# Altium schematic sheet Power_supply.SchDoc
size A; SheetNumber: 3; SheetTotal: 8
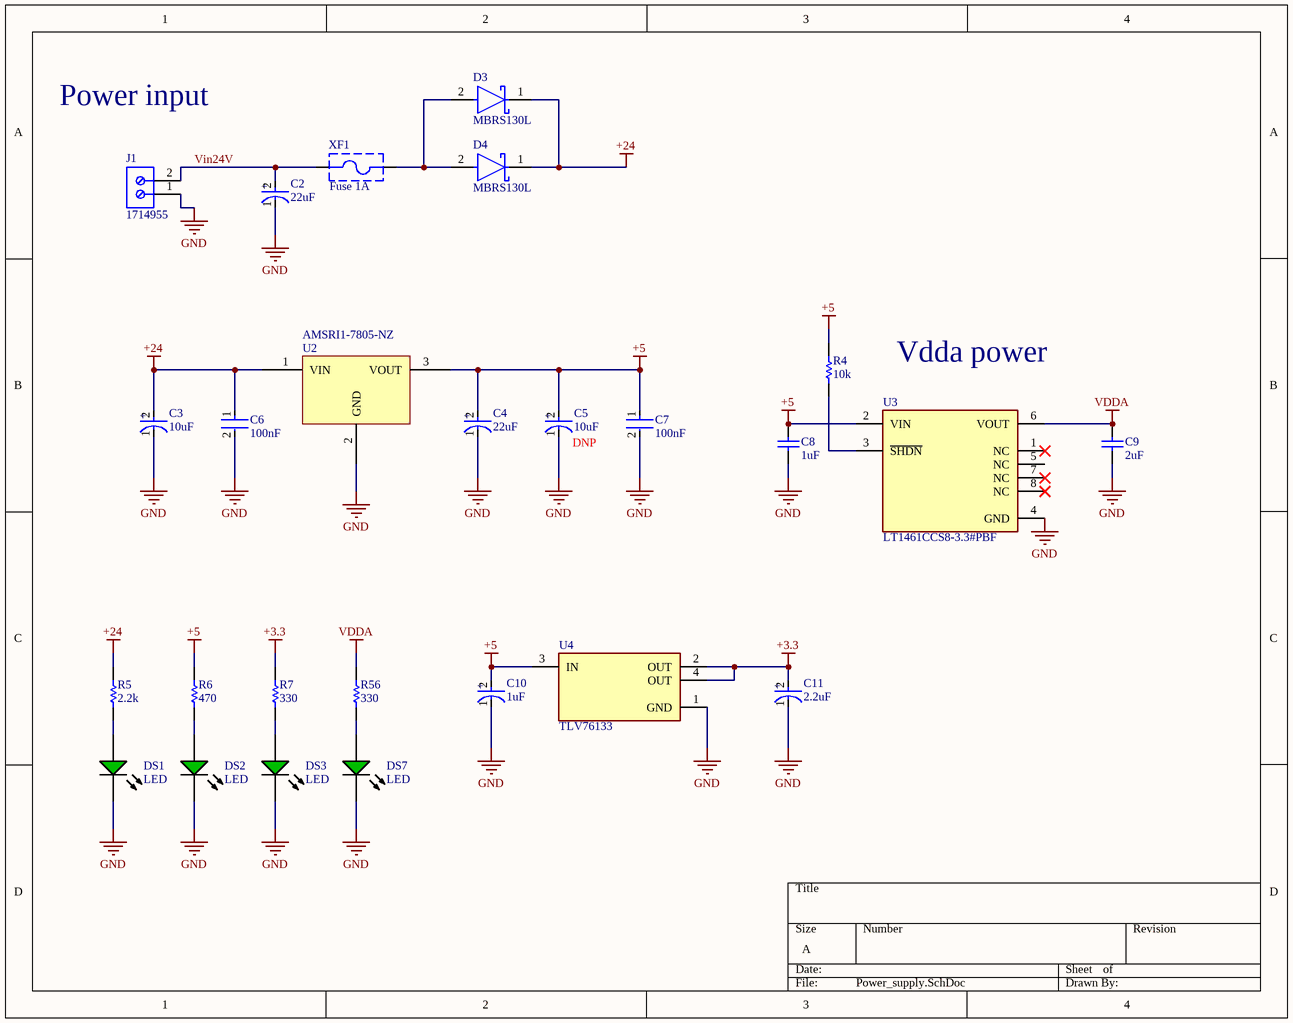
[diagram p0: Power_supply.SchDoc]

## Parts
C2  22uF  [FP-FCE-MFG]
C3  10uF  [FP-FKD-MFG]
C4  22uF  [FP-FCE-MFG]
C5  10uF  [FP-FKD-MFG]
C6  100nF  [FP-0805-L_2_01_0_2-W_1_25-IPC_B]
C7  100nF  [FP-0805-L_2_01_0_2-W_1_25-IPC_B]
C8  1uF  [CAPC2013X140X50LL20T25]
C9  2uF  [CAPC2013X140X50LL20T25]
C10  1uF  [FP-FKD-MFG]
C11  2.2uF  [FP-FKD-MFG]
D3  MBRS130L  [FP-403AF-MFG]
D4  MBRS130L  [FP-403AF-MFG]
DS1  LED  [AVAG-HSMX-C170_V]
DS2  LED  [AVAG-HSMX-C170_V]
DS3  LED  [AVAG-HSMX-C170_V]
DS7  LED  [AVAG-HSMX-C170_V]
J1  1714955  [PHOE-1714955_V]
R4  10k  [RESC2013X50X30LL20T20]
R5  2.2k  [RESC2013X50X30LL20T20]
R6  470  [RESC2013X50X30LL20T20]
R7  330  [RESC2013X50X30LL20T20]
R56  330  [RESC2013X50X30LL20T20]
U2  AMSRI1-7805-NZ  [SIP750W46P254L1400H1010Q3]
U3  LT1461CCS8-3.3#PBF  [FP-S8-8-05-08-1610-IPC_A]
U4  TLV76133  [FP-DCY0004A-MFG]
XF1  Fuse 1A  [696106003002]

## Nets
+3.3: C11.2(A) R7.2 U4.2(OUT) U4.4(OUT)
+5: C4.2(A) C5.2(A) C7.1 C8.2 C10.2(A) R4.2 R6.2 U2.3(VOUT) U3.2(VIN) U4.3(IN)
+24: C3.2(A) C6.1 D3.1(C) D4.1(C) R5.2 U2.1(VIN)
GND: C2.1(C) C3.1(C) C4.1(C) C5.1(C) C6.2 C7.2 C8.1 C9.1 C10.1(C) C11.1(C) DS1.2(K) DS2.2(K) DS3.2(K) DS7.2(K) J1.1 U2.2(GND) U3.4(GND) U4.1(GND)
VDDA: C9.2 R56.2 U3.6(VOUT)
Vin24V: C2.2(A) J1.2 XF1.1
NetD3_2: D3.2(A) D4.2(A) XF1.2
NetDS1_1: DS1.1(A) R5.1
NetDS2_1: DS2.1(A) R6.1
NetDS3_1: DS3.1(A) R7.1
NetDS7_1: DS7.1(A) R56.1
NetR4_1: R4.1 U3.3(~{SHDN})

Not connected (* = marked no-connect by the designer): U3 1(NC)* 5(NC) 7(NC)* 8(NC)*

## Notes on the sheet
- Power input
- Vdda power
- (near C5) DNP
- (in symbol CMP-2000-06207-2) +
- (in symbol CMP-05427-002128-1) +

## Library data of the parts
C2 C4 = CMP-05427-002128-1: CAP ALUM 22UF 20% 50V SMD; Ripple Current: 120mA; Material: Aluminium; ESR (Equivalent Series Resistance): 700mR; Polarity: Polar; Lead Length: 3.4mm; Leakage Current: 3uA; Life (Hours): 1000Hour; Diameter: 8mm; RoHS Compliant: Yes; Voltage Rating: 50V; Reach SVHC Compliant: Yes; Series: FC; Capacitance: 22uF; Ripple Current (AC): 120mA; Mount: Surface Mount; Min Operating Temperature: -40°C; Max Operating Temperature: 105°C; Radiation Hardening: No; Contact Plating: Tin; Impedance: 700mR; Construction: Cylindrical; Height - Seated (Max): 0.244inch; Packaging: Tape and Reel; Dielectric Material: Aluminium; Voltage: 50V; Voltage Rating (DC): 50V; Height: 6.2mm; Package Quantity: 1000; Length: 6.5mm; Lead Pitch: 2.2mm; Width: 8.3mm; Termination: SMD/SMT; Case/Package: Radial; Tolerance: 20%; Number of Pins: 2; Lead Free: Lead Free
C3 C5 C10 C11 = CMP-2000-06207-2: CAP ALUM 10UF 20% 50V SMD; Impedance: 880mR; Ripple Current: 165mA; Polarity: Polar; Leakage Current: 3uA; Lead Diameter: 0.65mm; Life (Hours): 2000Hour; REACH SVHC: No SVHC; Series: FK; Max Operating Temperature: 105°C; Radiation Hardening: No; Size: 5.8mm; Ripple Current (AC): 165mA; Lead Free: Lead Free; Voltage: 50V; Contact Plating: Tin; Case/Package: Radial; RoHS Compliant: Yes; Voltage Rating: 50V; Height - Seated (Max): 0.24inch; Package Quantity: 1000; Termination: SMD/SMT; Number of Pins: 2; Mount: Surface Mount; Packaging: Tape and Reel; Length: 5.8mm; Width: 7.8mm; Min Operating Temperature: -55°C; Height: 5.8mm; ESR (Equivalent Series Resistance): 880mR; Capacitance: 10uF; Diameter: 6.3mm; Voltage Rating (DC): 50V; Construction: Cylindrical; Tolerance: 20%; Lead Pitch: 1.8mm
C6 C7 = CMP-2007-04174-2: General Purpose Ceramic Capacitor, 0805, 10nF, 10%, X7R, 15%, 100V; Packaging: Tape and Reel; Min Operating Temperature: -55°C; Dielectric Material: Ceramic; Height: 1.4mm; Voltage Rating: 100V; Termination: SMD/SMT; Case Code (Imperial): 0805; Case Code (Metric): 2012; Case/Package: 0805; Construction: Flat; Radiation Hardening: No; Series: -; Dielectric: X7R; Package Quantity: 2000; Mount: Surface Mount; Capacitance: 100nF; Contact Plating: Tin; Voltage: 100V; Lead Free: Lead Free; Depth: 1.25mm; RoHS Compliant: Yes; Number of Pins: 2; Max Operating Temperature: 125°C; Length: 2.01mm; Voltage Rating (DC): 100V; Thickness: 0.055inch; REACH SVHC: No SVHC; Width: 0.049inch; Tolerance: 10%
C8 C9 = CMP-2007-03234-1: Part Number: C0805C105K3RACTU; Manufacturer: Kemet
D3 D4 = CMP-00278-20916186-1: MBRS130L Rectifier Diode, Schottky, 1 Phase, 1 Element, 2A, 30V V(RRM), Silicon, DO-214AA; Manufacturer Lifecycle Status: OBSOLETE; Output Current: 1A; Forward Voltage: 445mV; Peak Reverse Current: 1mA; Max Surge Current: 40A; Polarity: Standard; Element Configuration: Single; Max Junction Temperature (Tj): 125°C; Lead Free: Lead Free; Packaging: Cut Tape; Mount: Surface Mount; Max Repetitive Reverse Voltage (Vrrm): 30V; Forward Current: 2A; Length: 4.75mm; Weight: 180mg; Radiation Hardening: No; Max Operating Temperature: 125°C; Schedule B: 8541100080; Peak Non-Repetitive Surge Current: 40A; Height: 2.45mm; Case/Package: SMB; Min Operating Temperature: -65°C; Average Rectified Current: 2A; Lifecycle Status: Obsolete; REACH SVHC: No SVHC; Voltage Rating (DC): 30V; Max Forward Surge Current (Ifsm): 40A; NexarPartId: 20916186; Max Reverse Leakage Current: 1mA; Number of Pins: 2; Width: 3.95mm; RoHS: Compliant; Max Reverse Voltage (DC): 30V; Current Rating: 1A
DS1-DS3 DS7 = CMP-2000-05062-1: Chip LED, Green, 2.2 V, -40 to 85 degC, 2-Pin SMD, Pb-Free, Tape and Reel; Manufacturer: Avago; No. of Pins: 2; Peak Wavelength: 570nm; SVHC: NoSVHC(16-Jun-2014); Dominant Wavelength: 572nm; Forward Current If: 20mA; Viewing Angle: 170deg; Lens Shape: Rectangular; PIV Max: 5V; External Width: 1.25mm; LED Type: Standard; External Depth: 0.8mm; Opto Mounting Orientation: Top; Luminous Intensity: 15mcd; Luminous Intensity Min: 4mcd; Forward Voltage VF Max: 2.6V; External Length / Height: 2mm; Bulb Size: 1.25mmx1.4mm; Light Area Height: 1mm; Voltage Vf Typ: 2.2V; Operating Temperature Max: 85degC; Datasheet Version: Oct-08; MSL: MSL2A-4weeks; Peak Forward Current: 20mA; Package Description: 2-Pin Surface Mount Device, Body 2 x 1.25 mm, Height 0.8 mm; Datasheet URL: https://datasheet.ciiva.com/29280/180495-da-01-en-chip-led-hsmg-c170-gelb-gruen-29280971.pdf; Storage Temperature Min: -40degC; LED Colour: Green; Wavelength Typ: 570nm; Mounting Type: SMD; Forward Current If Max: 20mA; Dominant Wavelength Typ: 572nm; LED Mounting: SMD; Operating Temperature Range: -30degCto+85degC; Operating Temperature Min: -30degC; Manufacturer URL: http://www.avagotech.com/; Packaging: CutTape; Luminous Intensity Typ: 15mcd; Package Reference: HSMX-C170; Storage Temperature Max: 85degC; Opto Case Style: SMD; Forward Voltage: 2.2V
J1 = CMP-2000-05797-1: PC Terminal Block, Pitch 6.35 mm, 1 x 2 Position, Height 21.5 mm, Tail Lenght 5.1 mm, RoHS, Bulk; Manufacturer: Phoenix Contact; Package Description: PC Terminal Block, Pitch 6.35 mm, 1 x 2 Position, Height 21.5 mm, Tail Lenght 5.1 mm; Datasheet URL: http://media.digikey.com/pdf/Data%20Sheets/Phoenix%20Contact%20PDFs/1714955.pdf; Package Reference: 1714955; Manufacturer URL: http://www.phoenixcontact.com/; Datasheet Version: 02/2010; Mounting Technology: ThroughHole
R4-R7 R56 = CMP-2001-04896-1: Manufacturer: Vishay Dale; Part Number: CRCW08050000Z0EA
U2 = AMSRI1-7805-NZ: AMSRI1-7805-NZ, 5V / 1A DC output converter
U3 = CMP-09137-000077-1: IC VREF SERIES 0.08% 8SOIC; Output Type: Fixed; Max Output Current: 100mA; Reference Voltage: 3.3V; Quiescent Current: 50uA; Operating Supply Current: 70uA; Temperature Coefficient: 12ppm/°C; Max Input Voltage: 20V; Output Current: 100mA; Max Operating Temperature: 70°C; Width: 3.988mm; Series: -; REACH SVHC: No SVHC; RoHS Compliant: Yes; Length: 5mm; Case/Package: SOIC; Output Voltage: 3.3V; Mount: Surface Mount; Reference Type: Series; Package Quantity: 100; Min Output Voltage: 3.3V; Height: 1.498mm; Max Output Voltage: 3.3V; Min Operating Temperature: 0°C; Number of Pins: 8; Lead Free: Lead Free; Tolerance: 0.08%; Packaging: Rail/Tube
U4 = CMP-00370-134324849-1: TLV76133 1-A 16-V high-PSRR linear voltage regulator 4-SOT-223 -40 to 125; Manufacturer Lifecycle Status: ACTIVE; Number of Channels: 1; Min Supply Voltage: 6.5V; Nominal Supply Current: 65µA; Dropout Voltage: 900mV; Accuracy: 1%; Max Supply Voltage: 16V; Max Junction Temperature (Tj): 125°C; Output Current: 1A; Output Voltage: 5V; Width: 3.5mm; Length: 6.5mm; NexarPartId: 134324849; Max Operating Temperature: 125°C; Thickness: 1.6mm; Min Operating Temperature: -40°C; Case/Package: SOT-223; Height: 1.8mm; Lifecycle Status: Production; Number of Pins: 4; Number of Outputs: 1
XF1 = CMP-1502-00235-2: NexarPartId: 56808805; Fuse Current: 10A; Voltage Rating (AC): 250V; RoHS: Non-Compliant; Min Operating Temperature: -30°C; Height: 11.6mm; Packaging: Box; Mount: Through Hole; REACH SVHC: Unknown; Max Operating Temperature: 120°C